# EAGLE design powerBoard_v3 (EAGLE 6.6.0)
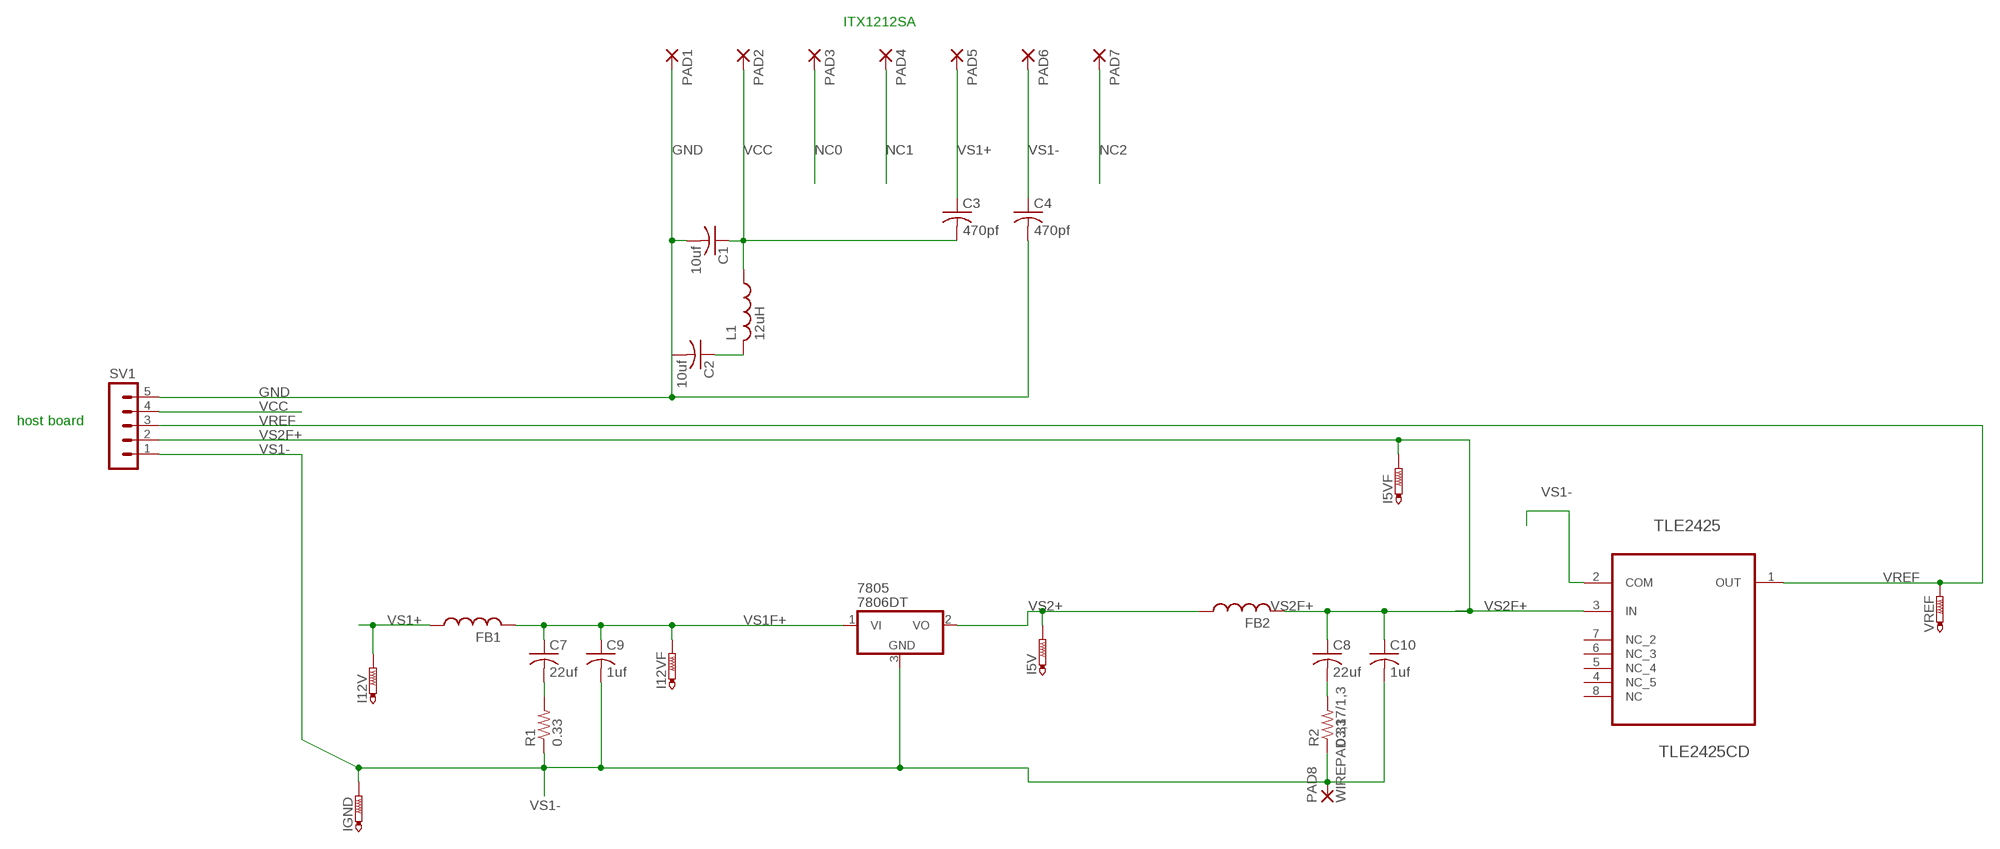
[diagram p0: schematic, sheet 1]

## Parts
7805  7806DT  [TO252]
C1  10uf  C-USC0805K  [C0805K]
C2  10uf  C-USC0805K  [C0805K]
C3  470pf  C-USC0805K  [C0805K]
C4  470pf  C-USC0805K  [C0805K]
C7  22uf  C-USC0805K  [C0805K]
C8  22uf  C-USC0805K  [C0805K]
C9  1uf  C-USC0805K  [C0805K]
C10  1uf  C-USC0805K  [C0805K]
FB1  L-USL2012C  [L2012C]
FB2  L-USL2012C  [L2012C]
I5V  PTR1PAD1-13  [P1-13]
I5VF  PTR1PAD1-13  [P1-13]
I12V  PTR1PAD1-13  [P1-13]
I12VF  PTR1PAD1-13  [P1-13]
IGND  PTR1PAD1-13  [P1-13]
L1  12uH  L-USL2012C  [L2012C]
PAD1  SMD2  [SMD1,27-2,54]
PAD2  SMD2  [SMD1,27-2,54]
PAD3  SMD2  [SMD1,27-2,54]
PAD4  SMD2  [SMD1,27-2,54]
PAD5  SMD2  [SMD1,27-2,54]
PAD6  SMD2  [SMD1,27-2,54]
PAD7  SMD2  [SMD1,27-2,54]
PAD8  WIREPAD3,17/1,3  [3,17/1,3]
R1  0.33  R-US_R2012W  [R2012W]
R2  0.33  R-US_R2012W  [R2012W]
SV1  MA05-1  [MA05-1]
TLE2425  TLE2425CD  [SOIC127P600X175-8N]
VREF  PTR1PAD1-13  [P1-13]

## Nets
GND: C1.2 C2.2 C4.2 PAD1.1(P) SV1.5
N$1: C2.1 L1.2
N$3: C8.2 R2.2
N$4: C7.2 R1.2
NC0: PAD3.1(P)
NC1: PAD4.1(P)
NC2: PAD7.1(P)
VCC: C1.1 C3.2 L1.1 PAD2.1(P) SV1.4
VREF: SV1.3 TLE2425.1(OUT) VREF.TP
VS1+: C3.1 FB1.1 I12V.TP PAD5.1(P)
VS1-: 7805.3(GND) C4.1 C9.2 C10.2 IGND.TP PAD6.1(P) PAD8.1(P) R1.1 R2.1 SV1.1 TLE2425.2(COM)
VS1F+: 7805.1(VI) C7.1 C9.1 FB1.2 I12VF.TP
VS2+: 7805.2(VO) FB2.1 I5V.TP
VS2F+: C8.1 C10.1 FB2.2 I5VF.TP SV1.2 TLE2425.3(IN)
Unconnected: TLE2425.4(NC_5) TLE2425.5(NC_4) TLE2425.6(NC_3) TLE2425.7(NC_2) TLE2425.8(NC)

## Notes on the sheet
- ITX1212SA
- host board

## Library data of the parts
7805 = linear:78*: Positive VOLTAGE REGULATOR Source: http://cache.national.com/ds/LM/LM78L05.pdf http://www.fairchildsemi.com/ds/LM/LM7805.pdf
C1-C4 C7-C10 = rcl:C-US: CAPACITOR, American symbol
FB1 FB2 = rcl:L-US: INDUCTOR, American symbol
I5V I5VF I12V I12VF IGND VREF = testpad:PTR1: TEST PIN
L1 = resistor:L-US: INDUCTOR, American symbol
PAD1-PAD7 = wirepad:SMD2: SMD PAD
PAD8 = wirepad:WIREPAD: Wire PAD connect wire on PCB
R1 R2 = resistor:R-US_: RESISTOR, American symbol
SV1 = con-lstb:MA05-1: PIN HEADER; OC_FARNELL: unknown; OC_NEWARK: unknown
TLE2425 = Texas Instruments_By_element14_Batch_1:TLE2425CD: PRECISION VIRTUAL GROUND; MPN: TLE2425CD; OC_FARNELL: 8454795; OC_NEWARK: 36K3652; PACKAGE: SOIC-8; SUPPLIER: Texas Instruments

## Board
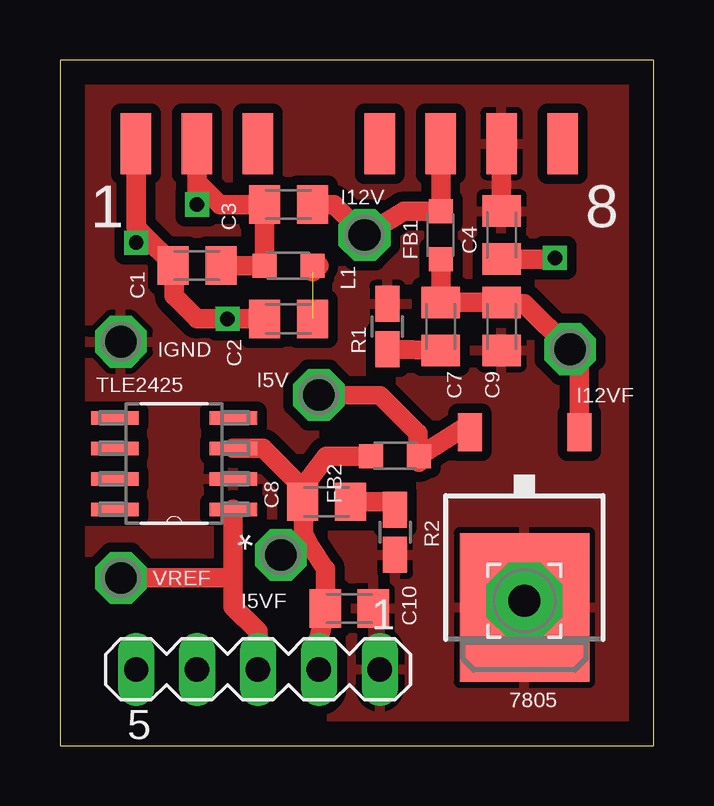
[diagram p1: board, top side]
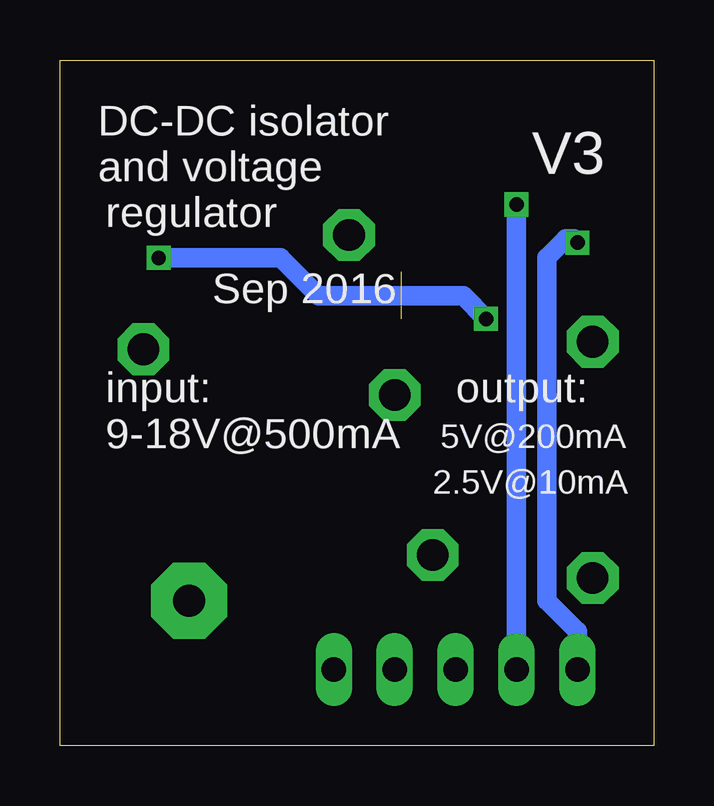
[diagram p2: board, bottom side, seen from below]

Size 24.75 x 28.57 mm. Coordinates in mm from the lower left corner, seen from the top.
Outline: 0,0 24.75,0 24.75,28.57 0,28.57 0,0
Copper layers (1*16): Top 0.035mm / dielectric 1.5mm / Bottom 0.035mm
Design rules "default *": minimum track width 10mil, minimum drill 10mil, track to track 8mil, track to pad 8mil, pad to pad 8mil, via to via 8mil, smd to smd 8mil, copper to edge 40mil, drill to drill 8mil, minimum pad ring 10mil, minimum via ring 8mil, stop-mask expansion 4mil, vias tented up to drill 0mil, thermal gap 10mil

### Footprints (pad centres in the part's own frame; a part is rotated, then mirrored left to right if it is on the bottom)
TO252 = smd 1 x 1.6: 1 -2.28,-4.8; 2 2.28,-4.8 | smd 5.4 x 6.2: 3 0,2.5
C0805K = smd 1.3 x 1.6: 1 -1,0; 2 1,0
L2012C = smd 1 x 1: 1 -1,0; 2 1,0
P1-13 = drill 1.321 pad 2.159 octagon: TP 0,0
SMD1,27-2,54 = smd 1.27 x 2.54: 1 0,0
3,17/1,3 = drill 1.321 pad 3.175 octagon: 1 0,0
R2012W = smd 1.5 x 1: 1 -0.94,0; 2 0.94,0
MA05-1 = drill 1.016 long: 1 -5.08,0; 2 -2.54,0; 3 0,0; 4 2.54,0; 5 5.08,0
SOIC127P600X175-8N = smd 1.981 x 0.559: 1 -2.464,1.905; 2 -2.464,0.635; 3 -2.464,-0.635; 4 -2.464,-1.905; 5 2.464,-1.905; 6 2.464,-0.635; 7 2.464,0.635; 8 2.464,1.905

### Placement (x,y rotation side)
7805  19.37,8.26 180 top
C1  5.71,20 180 top
C2  9.53,17.78 180 top
C3  9.53,22.54 180 top
C4  18.41,21.27 270 top
C7  15.88,17.46 270 top
C8  11.11,10.16 0 top
C9  18.41,17.46 270 top
C10  12.06,5.71 0 top
FB1  15.88,21.27 270 top
FB2  13.97,12.06 180 top
I5V  10.79,14.61 0 top
I5VF  9.21,7.94 0 top
I12V  12.7,21.27 0 top
I12VF  21.27,16.51 0 top
IGND  2.54,16.83 0 top
L1  9.53,20 0 top
PAD1  3.17,25.08 0 top
PAD2  5.71,25.08 0 top
PAD3  8.26,25.08 0 top
PAD4  13.34,25.08 0 top
PAD5  15.88,25.08 0 top
PAD6  18.41,25.08 0 top
PAD7  20.95,25.08 0 top
PAD8  19.37,6.03 0 top
R1  13.65,17.46 270 top
R2  13.97,8.89 90 top
SV1  8.26,3.17 180 top
TLE2425  4.76,11.75 180 top
VREF  2.54,6.99 0 top

### Tracks (layer width: path | path; a pad name or v marks a point on that pad's centre or on a via)
GND  (via drill 0.6)
  Top 0.813: 3.49,21.27 4.71,20.05 C1.2 4.76,19.95 4.76,18.73 5.71,17.78 v6.99,17.78 C2.2 | 3.49,21.27 3.17,21.59 PAD1.1 | v3.17,20.95 3.49,21.27 | C4.2 20.59,20.27 v20.64,20.32
  Bottom 0.813: SV1.5 3.17,4.76 4.45,6.03 4.45,20.32 3.65,21.11 3.33,21.11 v3.17,20.95 | v20.64,20.32 15.56,20.32 13.97,18.73 7.94,18.73 v6.99,17.78
N$1  (1 unrouted)
  Top 0.813: L1.2 10.79,20 10.53,19.73
N$3
  Top 0.813: C8.2 13.64,10.16 R2.2
N$4
  Top 0.813: R1.2 C7.2
VCC  (via drill 0.6)
  Top 0.813: C1.1 L1.1 C3.2 6.67,22.54 5.71,23.5 PAD2.1 v5.71,22.54
  Bottom 0.813: SV1.4 v5.71,22.54
VREF
  Top 0.813: TLE2425.1 7.23,6.99 | 7.23,6.99 7.23,5.79 8.26,4.76 SV1.3 | VREF.TP 7.23,6.99
VS1+
  Top 0.813: PAD5.1 FB1.1 14.34,22.27 I12V.TP 11.43,22.54 C3.1
VS1-
  Top 0.813: C4.1 PAD6.1
  pour Top (isolate 0.406): 0,0 24.77,0 24.77,28.57 0,28.57
VS1F+
  Top 0.813: FB1.2 C7.1 C9.1 18.46,18.41 19.37,18.41 I12VF.TP 21.65,16.14 7805.1
VS2+
  Top 0.762: 14.92,13.02 13.34,14.61 I5V.TP
  Top 0.813: 7805.2 17.08,13.38 FB2.1 14.97,11.79 14.92,13.02
VS2F+
  Top 0.406: I5VF.TP 9.53,8.26 10.48,8.26
  Top 0.762: 11.06,7.35 10.48,8.26 10.16,8.89
  Top 0.813: SV1.2 10.79,4.45 11.06,5.67 C10.1 11.06,7.35 | 10.16,8.89 10.16,10.11 C8.1 10.11,10.75 | 10.11,10.75 11.11,12.06 FB2.2 | TLE2425.3 8.48,12.38 10.11,10.75

### Text on the board
tNames: 1 | 8
bNames: DC-DC isolator | V3 | and voltage | regulator | Sep 2016 | output: | 5V@200mA | input: / 9-18V@500mA | 2.5V@10mA
tValues: 1